# EAGLE design kugarem_nosilk_fix (EAGLE 7.6.0)
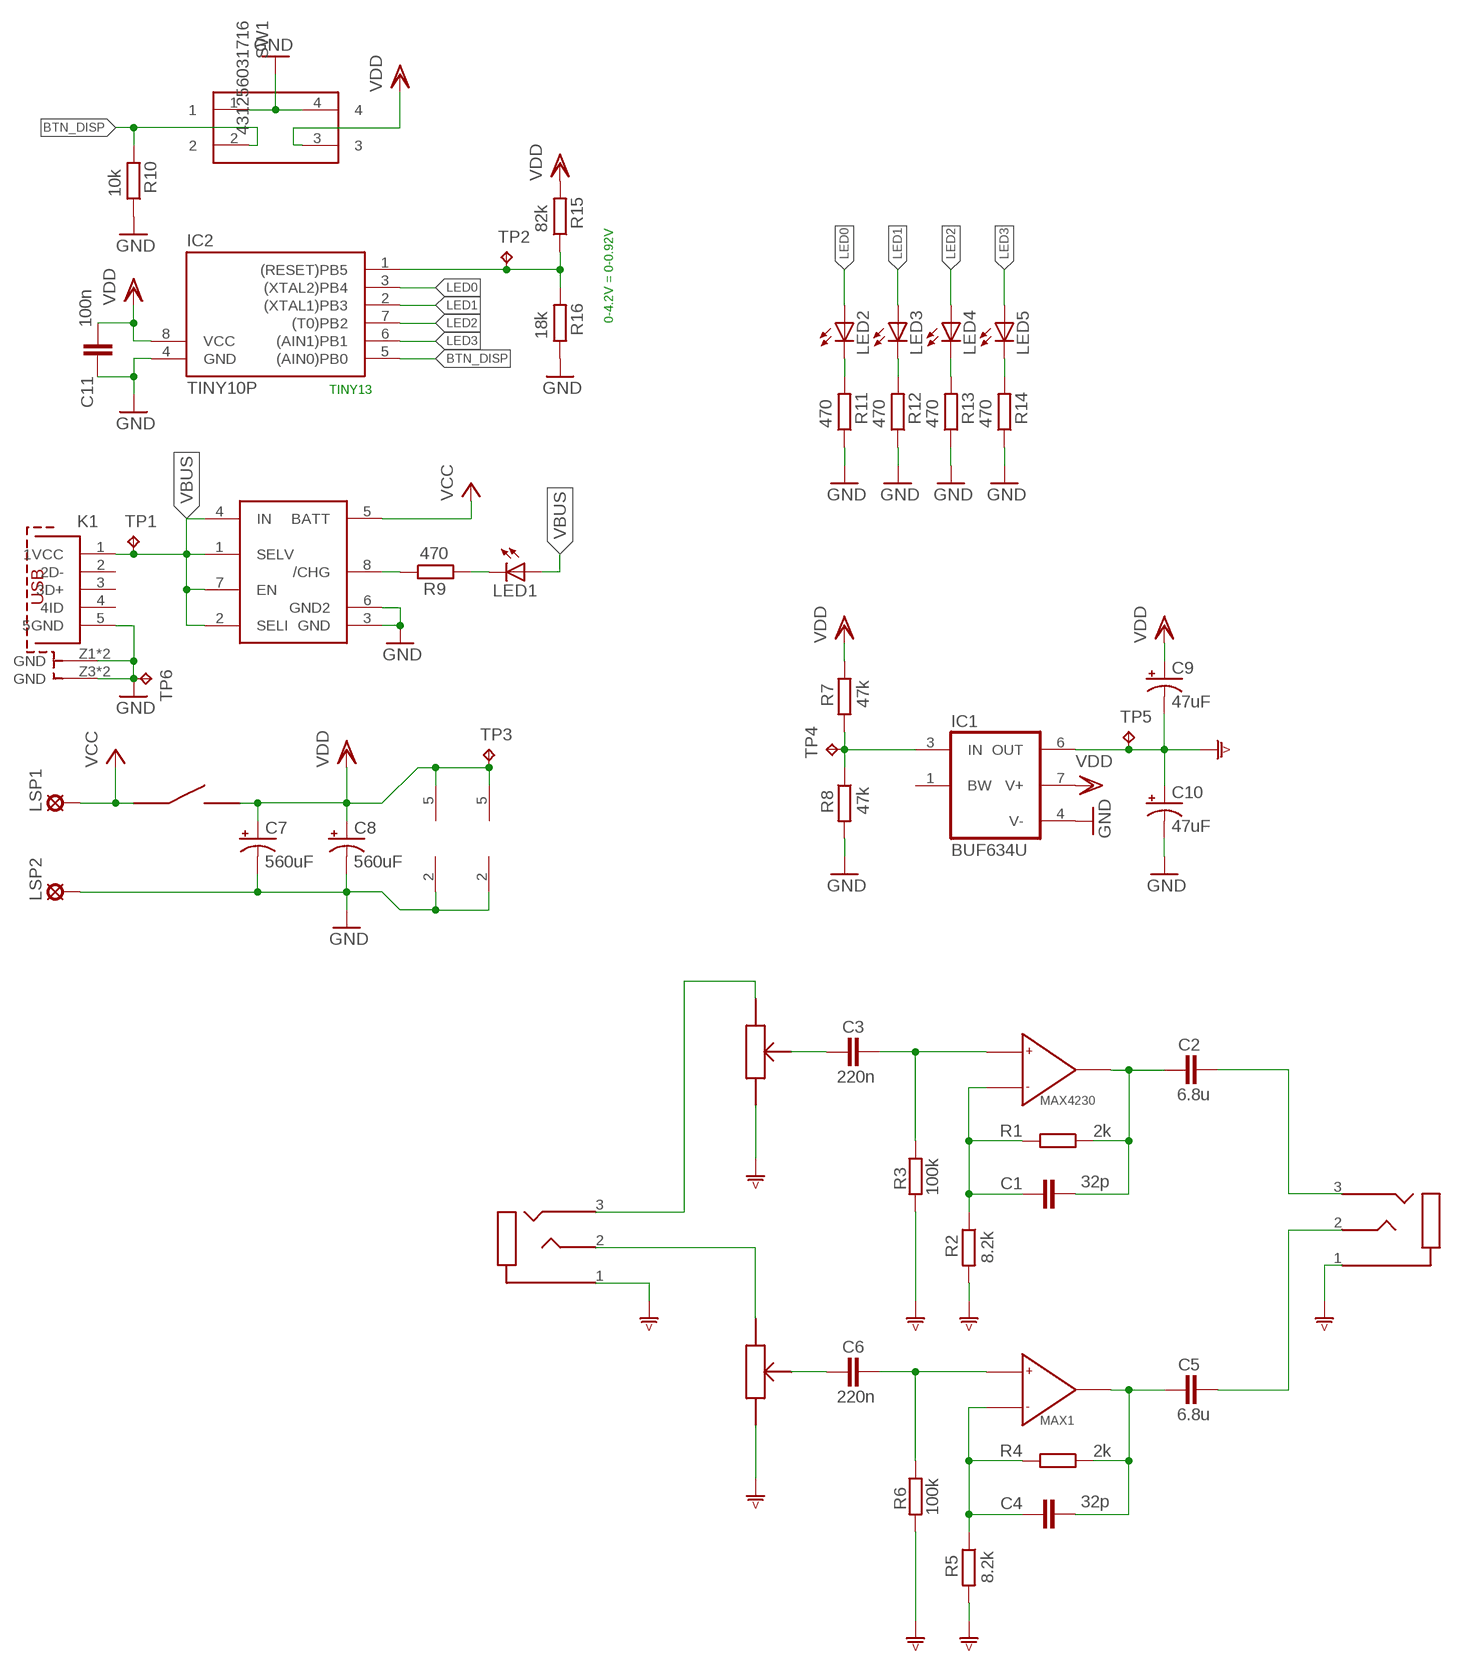
[diagram p0: schematic, sheet 1]

## Parts
C1  32p  C-EUC1206  [C1206]
C2  6.8u  C-EUC1206  [C1206]
C3  220n  C-EUC1206  [C1206]
C4  32p  C-EUC1206  [C1206]
C5  6.8u  C-EUC1206  [C1206]
C6  220n  C-EUC1206  [C1206]
C7  560uF  560UF-PANASONIC_G-25V-20%  [PANASONIC_G]
C8  560uF  560UF-PANASONIC_G-25V-20%  [PANASONIC_G]
C9  47uF  47UF-POLAR-PANASONIC_D-35V-20%  [PANASONIC_D]
C10  47uF  47UF-POLAR-PANASONIC_D-35V-20%  [PANASONIC_D]
C11  100n  C-EUC1206  [C1206]
IC1  BUF634U  [SO08]
IC2  TINY10P  [DIL08]
K1  629105150521  [629105150521]
LED1  LEDCHIPLED_1206  [CHIPLED_1206]
LED2  LEDCHIPLED_1206  [CHIPLED_1206]
LED3  LEDCHIPLED_1206  [CHIPLED_1206]
LED4  LEDCHIPLED_1206  [CHIPLED_1206]
LED5  LEDCHIPLED_1206  [CHIPLED_1206]
LSP1  LSP10  [LSP10]
LSP2  LSP10  [LSP10]
MAX1  MAX4230  [SOT23-5L]
MAX4230  MAX4230  [SOT23-5L]
R1  2k  R-EU_R1206  [R1206]
R2  8.2k  R-EU_R1206  [R1206]
R3  100k  R-EU_R1206  [R1206]
R4  2k  R-EU_R1206  [R1206]
R5  8.2k  R-EU_R1206  [R1206]
R6  100k  R-EU_R1206  [R1206]
R7  47k  R-EU_R1206  [R1206]
R8  47k  R-EU_R1206  [R1206]
R9  470  R-EU_R1206  [R1206]
R10  10k  R-EU_R1206  [R1206]
R11  470  R-EU_R1206  [R1206]
R12  470  R-EU_R1206  [R1206]
R13  470  R-EU_R1206  [R1206]
R14  470  R-EU_R1206  [R1206]
R15  82k  R-EU_R1206  [R1206]
R16  18k  R-EU_R1206  [R1206]
SW1  431256031716  [431256031716]
TP1  TPTP10SQ  [TP10SQ]
TP2  TPTP10SQ  [TP10SQ]
TP3  TPTP10SQ  [TP10SQ]
TP4  TPTP10SQ  [TP10SQ]
TP5  TPTP10SQ  [TP10SQ]
TP6  TPTP10SQ  [TP10SQ]
U$1  100k  PTR90  [PTR902]
U$2  SJ1-3515-SMT-TR  [STX-35332-3N-TR]
U$3  SJ1-3515-SMT-TR  [STX-35332-3N-TR]
U$4  MAX1811SO8  [SO08]

## Nets
BTN_DISP: IC2.5((AIN0)PB0) R10.2 SW1.2
GND: C7.- C8.- C10.- C11.1 IC1.4(V-) IC2.4(GND) K1.5(5GND) K1.Z1(GND) K1.Z2(GND) K1.Z3(GND) K1.Z4(GND) LSP2.MP MAX1.2(N) MAX4230.2(N) R8.2 R10.1 R11.1 R12.1 R13.1 R14.1 R16.1 SW1.1 SW1.4 TP6.TP U$4.3(GND) U$4.6(GND2)
LED0: IC2.3((XTAL2)PB4) LED2.A
LED1: IC2.2((XTAL1)PB3) LED3.A
LED2: IC2.7((T0)PB2) LED4.A
LED3: IC2.6((AIN1)PB1) LED5.A
N$1: C1.2 C2.1 MAX4230.4(OUT) R1.1
N$2: C1.1 MAX4230.3(IN-) R1.2 R2.1
N$3: C2.2 U$3.3(RING)
N$4: C3.2 MAX4230.1(IN+) R3.1
N$5: C4.2 C5.1 MAX1.4(OUT) R4.1
N$6: C4.1 MAX1.3(IN-) R4.2 R5.1
N$7: C3.1 U$1.R22
N$8: C6.2 MAX1.1(IN+) R6.1
N$9: C5.2 U$3.2(TIP)
N$10: C6.1 U$1.R12
N$11: U$1.R21 U$2.3(RING)
N$12: U$1.R11 U$2.2(TIP)
N$13: LED2.C R11.2
N$14: LED3.C R12.2
N$15: LED1.C R9.2
N$16: R9.1 U$4.8(/CHG)
N$17: IC1.3(IN) R7.2 R8.1 TP4.TP
N$18: LED4.C R13.2
N$19: LED5.C R14.2
N$20: IC2.1((RESET)PB5) R15.1 R16.2 TP2.TP
VBUS: K1.1(1VCC) LED1.A TP1.TP U$4.1(SELV) U$4.2(SELI) U$4.4(IN) U$4.7(EN)
VCC: LSP1.MP U$1.SW1 U$4.5(BATT)
VDD: C7.+ C8.+ C9.+ C11.2 IC1.7(V+) IC2.8(VCC) MAX1.5(P) MAX4230.5(P) R7.1 R15.2 SW1.3 TP3.TP U$1.SW2
VGND: C9.- C10.+ IC1.6(OUT) R2.2 R3.2 R5.2 R6.2 TP5.TP U$1.R13 U$1.R23 U$2.1(SLEEVE) U$3.1(SLEEVE)
Unconnected: IC1.1(BW) K1.2(2D-) K1.3(3D+) K1.4(4ID)

## Notes on the sheet
- 0-4.2V = 0-0.92V
- TINY13

## Library data of the parts
C1-C6 C11 = rcl:C-EU: CAPACITOR, European symbol
C7 C8 = SparkFun-Capacitors:560UF: 560µF polarized capacitors A capacitor is a passive two-terminal electrical component used to store electrical energy temporarily in an electric field.; PROD_ID: CAP-09983
C9 C10 = SparkFun-Capacitors:47UF-POLAR: 47µF polarized capacitors A capacitor is a passive two-terminal electrical component used to store electrical energy temporarily in an electric field.; PROD_ID: CAP-08478
IC1 = burr-brown:BUF634: 250mA High-Speed Buffer; MF: TEXAS INSTRUMENTS; MPN: BUF634U; OC_FARNELL: 4733617; OC_NEWARK: 27C6567
IC2 = atmel:TINY10: MICROCONTROLLER 1 Kbytes ROM; OC_FARNELL: unknown; OC_NEWARK: unknown
K1 = Input-Output_Connectors_rev15d:629105150521: WR-COM_USB_Micro Type B_Horizontal_SMT ; Micro Type B Horizontal SMT - 3A current at Pin1 & Pin 5 - with Pegs and THT shielding Pins - T&R Packaging Code : Con_I-O_COM_USB_2.0_B_629105150521_629105150521 <http://katalog.we-online.de/media/images/eican/Con_I-O_COM_USB_2.0_B_629105150521_pf2.jpg> Details see: http://katalog.we-online.de/em/datasheet/629105150521.pdf Created 12/08/2014, Dan Xu 2014 (C) Wurth Elektronik
LED1-LED5 = led:LED: LED OSRAM: - CHIPLED LG R971, LG N971, LY N971, LG Q971, LY Q971, LO R971, LY R971 LH N974, LH R974 LS Q976, LO Q976, LY Q976 LO Q996 - Hyper CHIPLED LW Q18S LB Q993, LB Q99A, LB R99A - SideLED LS A670, LO A670, LY A670, LG A670, LP A670 LB A673, LV A673, LT A673, LW A673 LH A674 LY A675 LS A676, LA A676, LO A676, LY A676, LW A676 LS A679, LY A679, LG A679 - Hyper Micro SIDELED® LS Y876, LA Y876, LO Y876, LY Y876 LT Y87S - SmartLED LW L88C, LW L88S LB L89C, LB L89S, LG L890 LS L89K, LO L89K, LY L89K LS L896, LA L896, LO L896, LY L896 - TOPLED LS T670, LO T670, LY T670, LG T670, LP T670 LSG T670, LSP T670, LSY T670, LOP T670, LYG T670 LG T671, LOG T671, LSG T671 LB T673, LV T673, LT T673, LW T673 LH T674 LS T676, LA T676, LO T676, LY T676, LB T676, LH T676, LSB T676, LW T676 LB T67C, LV T67C, LT T67C, LS T67K, LO T67K, LY T67K, LW E67C LS E67B, LA E67B, LO E67B, LY E67B, LB E67C, LV E67C, LT E67C LW T67C LS T679, LY T679, LG T679 LS T770, LO T770, LY T770, LG T770, LP T770 LB T773, LV T773, LT T773, LW T773 LH T774 LS E675, LA E675, LY E675, LS T675 LS T776, LA T776, LO T776, LY T776, LB T776 LHGB T686 LT T68C, LB T68C - Hyper Mini TOPLED® LB M676 - Mini TOPLED Santana® LG M470 LS M47K, LO M47K, LY M47K Source: http://www.osram.convergy.de LUXEON: - LUMILED® LXK2-PW12-R00, LXK2-PW12-S00, LXK2-PW14-U00, LXK2-PW14-V00 LXK2-PM12-R00, LXK2-PM12-S00, LXK2-PM14-U00 LXK2-PE12-Q00, LXK2-PE12-R00, LXK2-PE12-S00, LXK2-PE14-T00, LXK2-PE14-U00 LXK2-PB12-K00, LXK2-PB12-L00, LXK2-PB12-M00, LXK2-PB14-N00, LXK2-PB14-P00, LXK2-PB14-Q00 LXK2-PR12-L00, LXK2-PR12-M00, LXK2-PR14-Q00, LXK2-PR14-R00 LXK2-PD12-Q00, LXK2-PD12-R00, LXK2-PD12-S00 LXK2-PH12-R00, LXK2-PH12-S00 LXK2-PL12-P00, LXK2-PL12-Q00, LXK2-PL12-R00 Source: www.luxeon.com KINGBRIGHT: KA-3528ASYC Source: www.kingbright.com
LSP1 LSP2 = solpad:LSP10: SOLDER PAD drill 1.0 mm, distributor Buerklin, 12H555
MAX1 MAX4230 = kugarem-lib:MAX4230
R1-R16 = rcl:R-EU_: RESISTOR, European symbol
SW1 = Switches_rev16a:431256031716: WS-TST, 6*6mm right angle Tact switch,THT, height 3.15mm, 4 pins, black actuator, 160gf
TP1-TP6 = testpad:TP: Test pad
U$1 = Kuga2_parts:PTR90
U$2 U$3 = Kuga2_parts:SJ1-3515-SMT-TR
U$4 = adafruit:MAX1811: Maxim MAX1811 USB li-ion battery charger http://www.ladyada.net/library/eagle

## Board
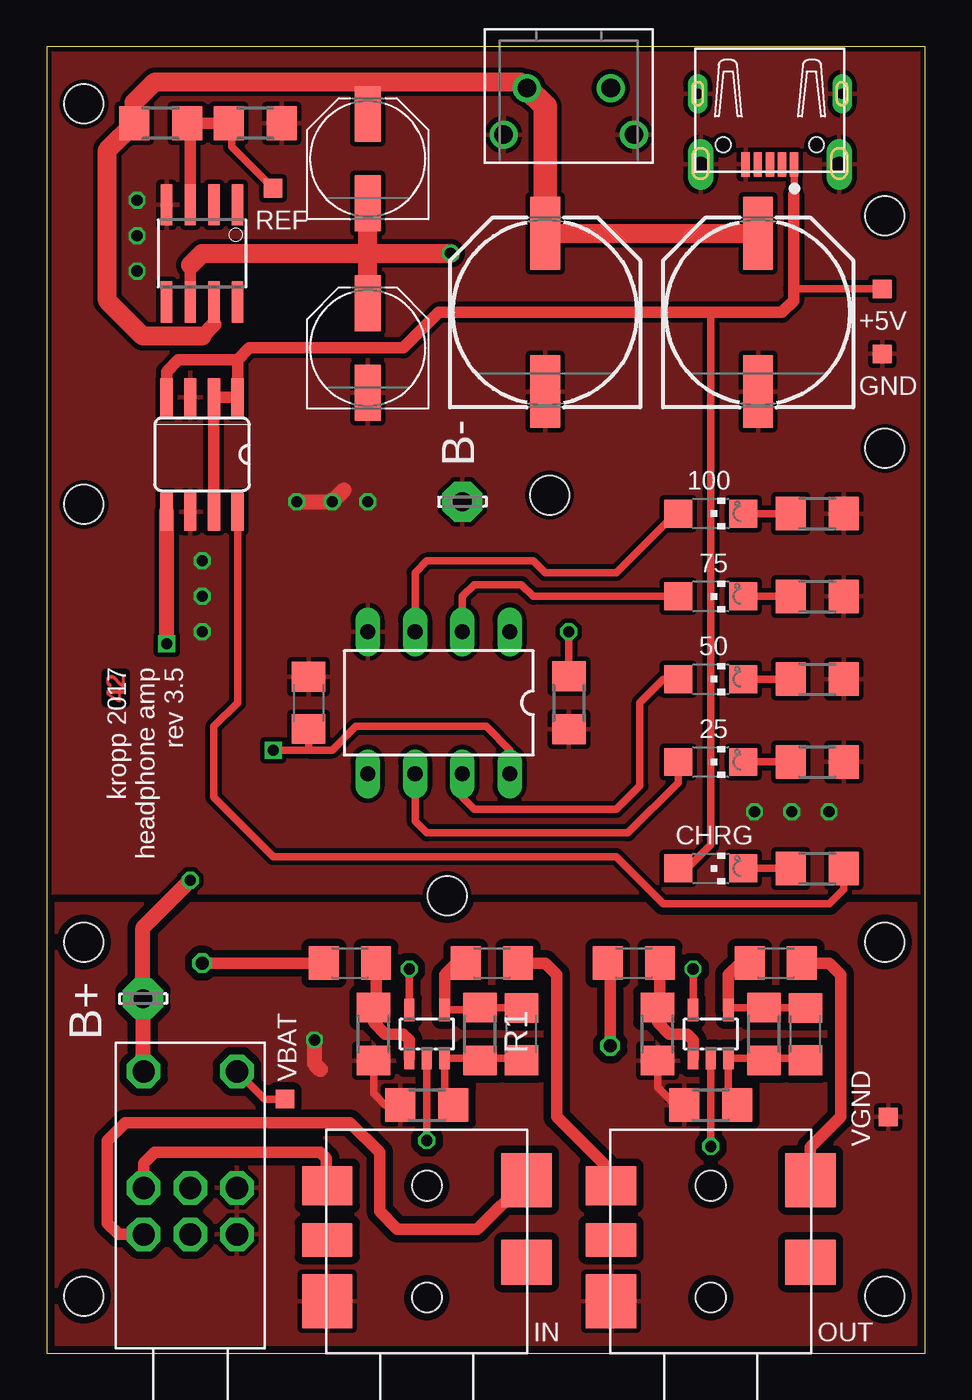
[diagram p1: board, top side]
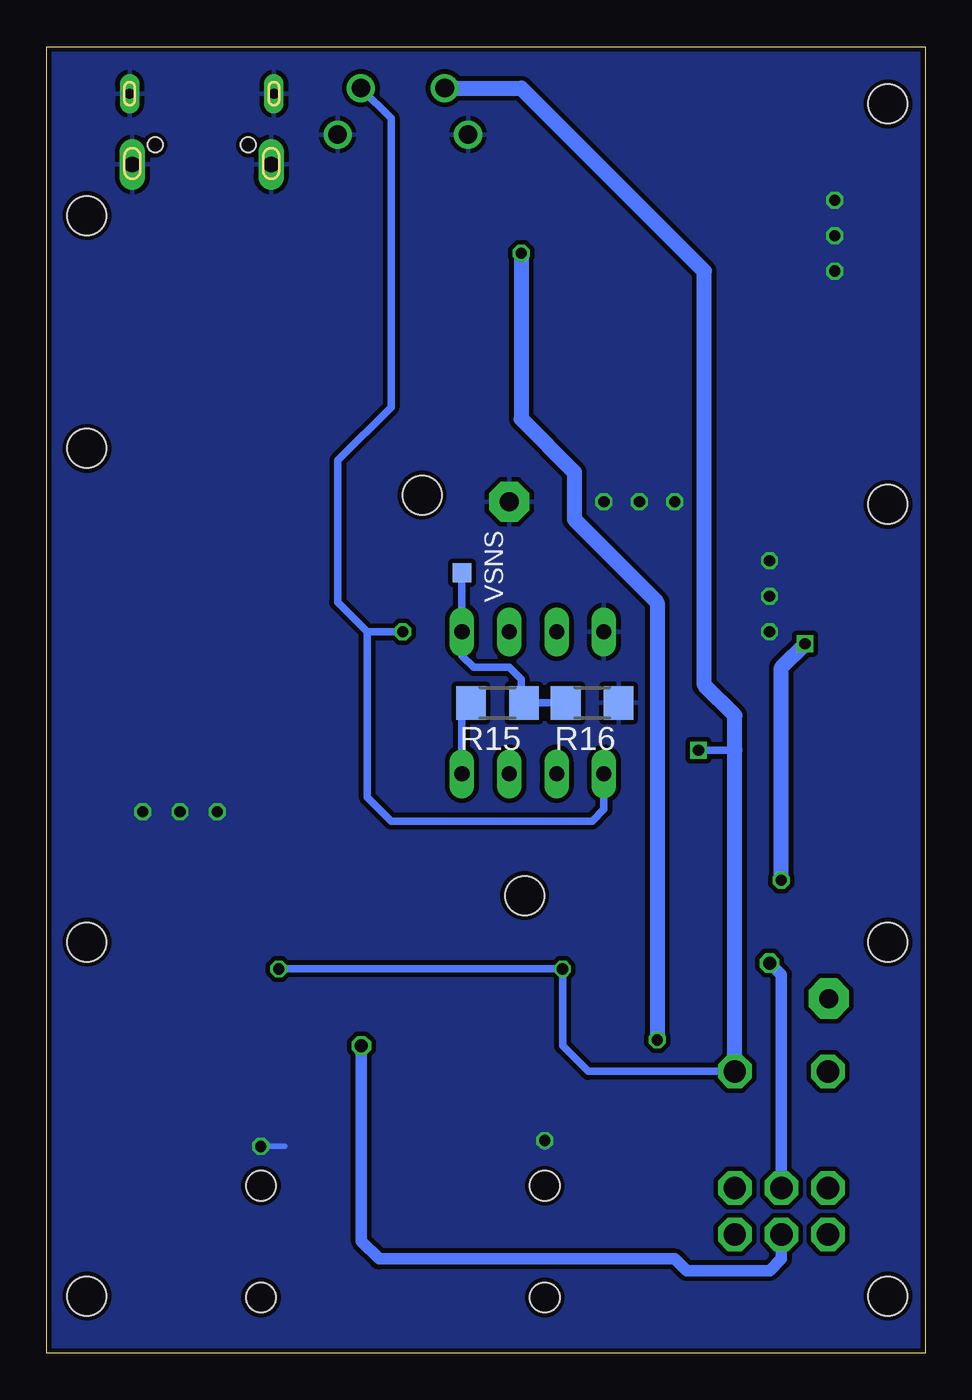
[diagram p2: board, bottom side, seen from below]

Size 47.16 x 70.16 mm. Coordinates in mm from the lower left corner, seen from the top.
Outline: 0,0 47.16,0 47.16,70.16 0,70.16 0,0
Copper layers (1*16): Top 0.035mm / dielectric 1.5mm / Bottom 0.035mm
Design rules "SeeedStudio_2layer_DRU_no_angle_20140221": minimum track width 6mil, minimum drill 12mil, track to track 6mil, track to pad 6mil, pad to pad 6mil, via to via 6mil, smd to smd 0mil, copper to edge 10mil, drill to drill 10mil, minimum pad ring 10mil, minimum via ring 6mil, stop-mask expansion 2mil, vias tented up to drill 100mil, thermal gap 10mil
Holes 2.1 mm at 2,3.08 2,22.08 45,3.08 45,22.08 45,48.58 2,45.58 2,67.08 27,46.08 45,61.08 21.5,24.58

### Footprints (pad centres in the part's own frame; a part is rotated, then mirrored left to right if it is on the bottom)
C1206 = smd 1.6 x 1.8: 1 -1.4,0; 2 1.4,0
PANASONIC_G = smd 3.9 x 1.6: + 4.25,0; - -4.25,0
PANASONIC_D = smd 3 x 1.4: + 2.4,0; - -2.4,0
SO08 = smd 0.61 x 2.21: 1 -1.905,-2.616; 2 -0.635,-2.616; 3 0.635,-2.616; 4 1.905,-2.616; 5 1.905,2.616; 6 0.635,2.616; 7 -0.635,2.616; 8 -1.905,2.616
DIL08 = drill 0.813 long: 1 -3.81,-3.81; 2 -1.27,-3.81; 3 1.27,-3.81; 4 3.81,-3.81; 5 3.81,3.81; 6 1.27,3.81; 7 -1.27,3.81; 8 -3.81,3.81
629105150521 = smd 0.45 x 1.3: 1 -1.3,3.8; 2 -0.65,3.8; 3 0,3.8; 4 0.65,3.8; 5 1.3,3.8 | drill 0.85 pad 1.2 long: Z1 -3.725,3.8; Z2 3.725,3.8 | drill 0.55 pad 0.9 long: Z3 3.875,0; Z4 -3.875,0 | hole 0.8: -2.5,2.75; 2.5,2.75
CHIPLED_1206 = smd 1.5 x 1.5: A 0,-1.75; C 0,1.75
LSP10 = drill 1.016 pad 2.159 octagon: MP 0,0
SOT23-5L = smd 0.55 x 1.2: 1 -0.95,-1.3; 2 0,-1.3; 3 0.95,-1.3; 4 0.95,1.3; 5 -0.95,1.3
R1206 = smd 1.6 x 1.803: 1 -1.422,0; 2 1.422,0
431256031716 = drill 1: 1 -3.5,1.25; 2 -2.25,-1.25; 3 2.25,-1.25; 4 3.5,1.25
TP10SQ = smd 1 x 1: TP 0,0
PTR902 = drill 1.2 octagon: R11 2.5,-2.5; R12 2.5,0; R13 2.5,2.5; R21 0,-2.5; R22 0,0; R23 0,2.5; SW1 -6.25,-2.5; SW2 -6.25,2.5
STX-35332-3N-TR = smd 2.9 x 2.7: 1 2.8,5.35; 2 9.3,-5.35 | smd 2.1 x 2.7: 3 9,5.35 | smd 2.4 x 2.7: 10 4.9,-5.35 | smd 1.8 x 2.7: 11 6.1,5.35 | hole 1.6: 3,0; 9,0
SO08' = smd 0.66 x 2.032: 1 -1.905,-3.073; 2 -0.635,-3.073; 3 0.635,-3.073; 4 1.905,-3.073; 5 1.905,3.073; 6 0.635,3.073; 7 -0.635,3.073; 8 -1.905,3.073

### Placement (x,y rotation side)
C1  25.5,17.14 90 top
C2  23.91,20.95 0 top
C3  16.29,20.95 0 top
C4  40.73,17.14 90 top
C5  39.15,20.95 0 top
C6  31.53,20.95 0 top
C7  38.2,55.88 90 top
C8  26.77,55.88 90 top
C9  17.24,64.14 90 top
C10  17.24,53.98 90 top
C11  14.06,34.92 270 top
IC1  8.35,59.05 180 top
IC2  21.05,34.92 180 top
K1  38.83,67.63 180 top
LED1  35.66,26.03 270 top
LED2  35.66,45.09 270 top
LED3  35.66,40.64 270 top
LED4  35.66,36.2 270 top
LED5  35.66,31.75 270 top
LSP1  5.17,19.05 0 top
LSP2  22.32,45.72 0 top
MAX1  35.66,17.14 0 top
MAX4230  20.41,17.14 0 top
R1  23.27,17.14 270 top
R2  20.41,13.34 180 top
R3  17.56,17.14 270 top
R4  38.51,17.14 270 top
R5  35.66,13.34 180 top
R6  32.8,17.14 270 top
R7  6.13,66.04 0 top
R8  11.21,66.04 0 top
R9  41.37,26.03 180 top
R10  28.04,34.92 90 top
R11  41.37,45.09 180 top
R12  41.37,40.64 180 top
R13  41.37,36.2 180 top
R14  41.37,31.75 180 top
R15  22.95,34.92 180 bottom
R16  17.88,34.92 180 bottom
SW1  28.04,66.67 180 top
TP1  44.86,57.15 0 top
TP2  24.86,41.91 0 bottom
TP3  12.79,13.65 0 top
TP4  12.16,62.55 0 top
TP5  45.18,12.7 0 top
TP6  44.86,53.66 0 top
U$1  7.71,8.89 270 top
U$2  20.41,0 90 top
U$3  35.66,0 90 top
U$4  MAX1811SO8  [SO08']  8.35,48.26 180 top

### Tracks (layer width: path | path; a pad name or v marks a point on that pad's centre or on a via)
BTN_DISP  (via drill 0.6)
  Top 0.406: v28.04,38.73 R10.2
  Bottom 0.254: 31.53,40.34 31.54,40.33
  Bottom 0.406: 29.94,38.73 31.54,40.33 | 31.53,40.34 31.53,47.94 28.67,50.8 28.67,66.31 SW1.2 | IC2.5 17.24,29.21 17.88,28.58 28.67,28.58 29.94,29.84 29.94,38.73 | 29.94,38.73 v28.04,38.73
GND  (via drill 0.6)
  Top 0.406: MAX1.2 v35.66,11.11 | MAX4230.2 v20.41,11.43
  Top 0.813: v13.43,45.72 v15.34,45.72 15.97,46.35
  Bottom 0.305: v35.66,11.11 34.38,11.11
  Bottom 0.406: v20.41,11.43 20.41,11.11
  other vias: 17.24,45.72 8.35,42.55 8.35,40.64 8.35,38.73 4.86,61.91 4.86,60.01 4.86,58.1 38,29.08 40,29.08 42,29.08
  pour Top (isolate 0.254): -1,70.48 54.18,70.48 54.18,24.77 -1,24.77
  pour Bottom (isolate 0.254): -1,70.48 54.18,70.48 54.18,0 -1,0
LED0
  Top 0.406: LED2.A 33.75,45.09 30.57,41.91 26.77,41.91 26.13,42.55 20.41,42.55 19.78,41.91 IC2.3
LED1
  Top 0.406: LED3.A 26.13,40.64 25.5,41.27 22.95,41.27 22.32,40.64 IC2.2
LED2
  Top 0.406: IC2.7 22.32,29.84 22.95,29.21 30.57,29.21 31.84,30.48 31.84,34.92 33.11,36.2 LED4.A
LED3
  Top 0.406: LED5.A 33.91,30.63 31.21,27.94 20.41,27.94 19.78,28.58 IC2.6
N$1
  Top 0.406: C2.1 22,20.95 | MAX4230.4 23.15,18.45 R1.1 25.47,18.57 C1.2
  Top 0.61: 22,20.95 21.37,20.32 MAX4230.4
N$2
  Top 0.406: R2.1 21.36,13.81 MAX4230.3 23.15,15.85 | 23.15,15.85 R1.2 | 23.15,15.85 25.39,15.85 C1.1
N$3
  Top 0.61: C2.2 26.77,20.95 27.4,20.32 27.4,12.7 29.94,10.16 29.94,9.37 U$3.3
N$4
  Top 0.406: 17.72,18.57 R3.1 17.54,18.55 17.69,18.55 | MAX4230.1
  Top 0.61: MAX4230.1 19.46,16.83 19.14,17.14 18.19,17.14 17.56,17.78 R3.1 17.69,18.7 C3.2
N$5
  Top 0.406: C4.2 38.53,18.55 R4.1 36.73,18.57 MAX1.4
  Top 0.61: MAX1.4 36.6,20.32 37.24,20.95 C5.1
N$6
  Top 0.406: R5.1 36.6,13.81 MAX1.3 38.39,15.85 | 38.39,15.85 R4.2 | 38.39,15.85 40.63,15.85 C4.1
N$7  (via drill 0.7)
  Top 0.61: v8.35,20.95 C3.1
  Bottom 0.61: U$1.R22 7.71,20.32 v8.35,20.95
N$8
  Top 0.61: MAX1.1 34.7,16.82 34.38,17.14 33.43,17.14 32.8,17.78 R6.1 32.93,18.7 C6.2
N$9
  Top 0.61: U$3.2 41.01,11.07 42.64,12.7 42.64,20.32 42.01,20.95 C5.2
N$10  (via drill 0.7)
  Top 0.61: v30.26,16.51 30.26,20.82 C6.1
  Bottom 0.61: U$1.R12 7.71,5.08 8.35,4.45 12.79,4.45 13.43,5.08 29.3,5.08 30.26,6.03 v30.26,16.51
N$11
  Top 0.61: U$1.R21 5.21,10.2 5.81,10.79 14.7,10.79 15.02,10.48 15.02,9.05 U$2.3
N$12
  Top 0.61: U$1.R11 3.87,6.39 3.27,6.99 3.27,11.43 4.22,12.38 16.29,12.38 17.88,10.79 17.88,7.62 18.83,6.67 23.13,6.67 U$2.2
N$13
  Top 0.406: LED2.C R11.2
N$14
  Top 0.406: LED3.C R12.2
N$15
  Top 0.406: LED1.C R9.2
N$16
  Top 0.406: R9.1 42.79,24.92 42.01,24.13 33.11,24.13 30.57,26.67 12.16,26.67 8.98,29.84 8.98,33.66 10.26,34.92 U$4.8
N$17
  Top 0.406: TP4.TP 9.94,64.77 9.94,65.89 R8.1
  Top 0.61: R8.1 R7.2 7.71,65.87 IC1.3
N$18
  Top 0.406: LED4.C R13.2
N$19
  Top 0.406: LED5.C R14.2
N$20
  Bottom 0.406: R16.2 R15.1 21.68,35.08 21.68,36.2 22.32,36.83 24.23,36.83 24.86,37.46 IC2.1 TP2.TP
VBUS
  Top 0.406: 40.1,62.23 40.13,62.26 K1.1 | 35.66,55.88 35.66,27.3 34.38,26.03 LED1.A | TP1.TP 40.1,57.15
  Top 0.61: U$4.7 U$4.2 U$4.1 10.26,53.34 | 40.1,62.23 40.1,57.15 40.1,56.52 39.47,55.88 35.66,55.88 21.05,55.88 19.14,53.98 10.89,53.98 10.26,53.34 | U$4.4 6.45,52.7 7.08,53.34 10.26,53.34
VCC  (via drill 0.6)
  Top 0.813: U$1.SW1 5.17,15.18 LSP1.MP 5.17,22.86 v7.71,25.4 | v6.45,38.1 U$4.5
  Bottom 0.813: v7.71,25.4 7.71,36.83 v6.45,38.1
VDD  (via drill 0.6)
  Top 0.305: MAX4230.5 | MAX1.5
  Top 0.406: C11.2 14.06,32.38 | v19.46,20.64 MAX4230.5 | v34.7,20.64 MAX1.5 | 14.06,32.38 15.34,32.38 16.61,33.66 23.59,33.66 24.86,32.38 IC2.8 | 14.06,32.38 v12.16,32.38 | TP3.TP 11.7,13.65 U$1.SW2
  Top 0.61: IC1.7 8.98,55.24 | 4.54,65.87 R7.1
  Top 0.813: 8.98,55.24 8.35,54.61
  Top 1.016: C8.+ C7.+ | 8.35,54.61 5.17,54.61 3.27,56.52 3.27,64.61 R7.1 4.71,67.16 5.81,68.26 17.24,68.26 | 17.24,68.26 25.45,68.26 SW1.3 | C9.+ 17.24,68.26
  Top 1.27: C8.+ 26.77,66.95 SW1.3
  Bottom 0.406: U$1.SW2 18.09,15.14 19.46,16.51 v19.46,20.64 v34.7,20.64 | IC2.8 24.86,34.44 R15.2 | v12.16,32.38 10.21,32.38
  Bottom 0.813: U$1.SW2 10.21,32.38 10.21,34.25 11.84,35.88 11.84,58.1 21.66,67.92 SW1.3
VGND  (via drill 0.6)
  Top 0.406: R3.2 17.56,13.97 18.19,13.34 R2.2 | R6.2 32.8,14.29 33.75,13.34 R5.2
  Top 0.61: IC1.6 7.71,58.42
  Top 0.813: v14.38,16.83 14.38,15.56 14.7,15.24
  Top 1.016: C10.+ 17.24,59.05 | 17.24,59.05 C9.- | 7.71,58.42 8.35,59.05 17.24,59.05 | 17.24,59.05 v21.68,59.05
  Bottom 0.813: v21.68,59.05 21.68,50.16 18.83,47.31 18.83,44.77 14.38,40.32 v14.38,16.83
  pour Top (isolate 0.406, rank 2): -1.13,24.13 54.45,24.13 54.45,-0.63 -1.13,-0.63

### Text on the board
Top: 42
tPlace: REF | +5V | GND | VBAT | VGND
bPlace: VSNS
tNames: B- | 100 | 75 | kropp 2017 / headphone amp / rev 3.5 | 50 | 25 | CHRG | B+ | IN | OUT